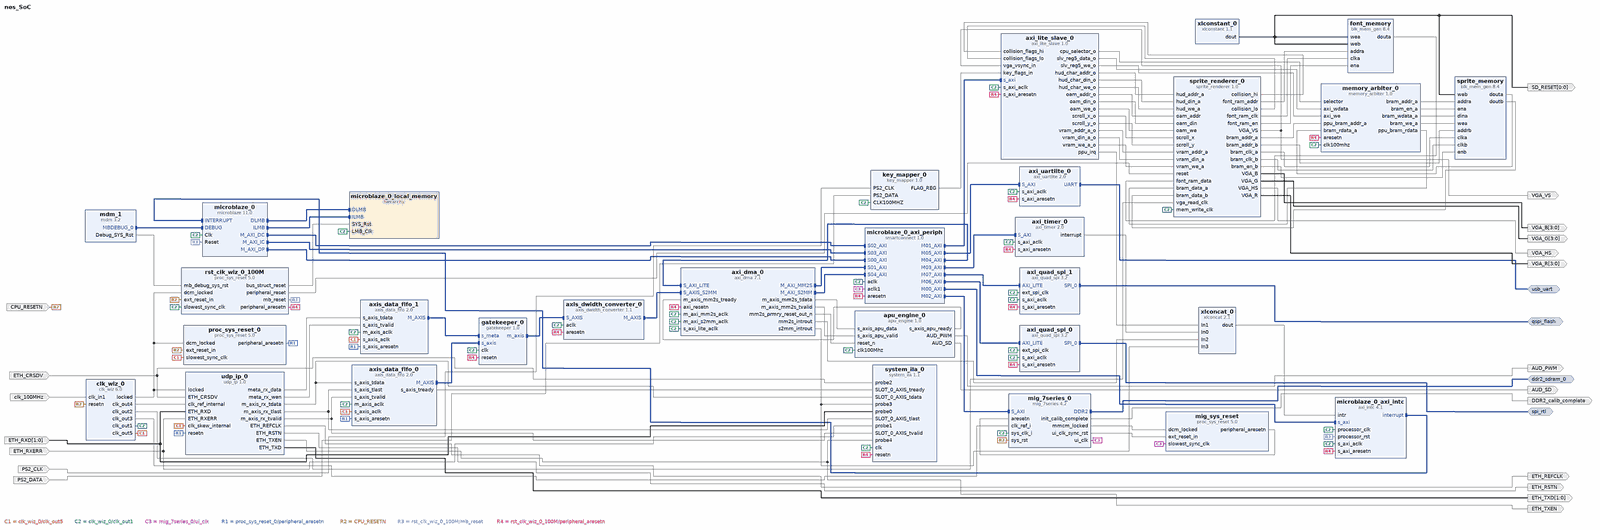
[diagram p0: block diagram of the top level, whole]
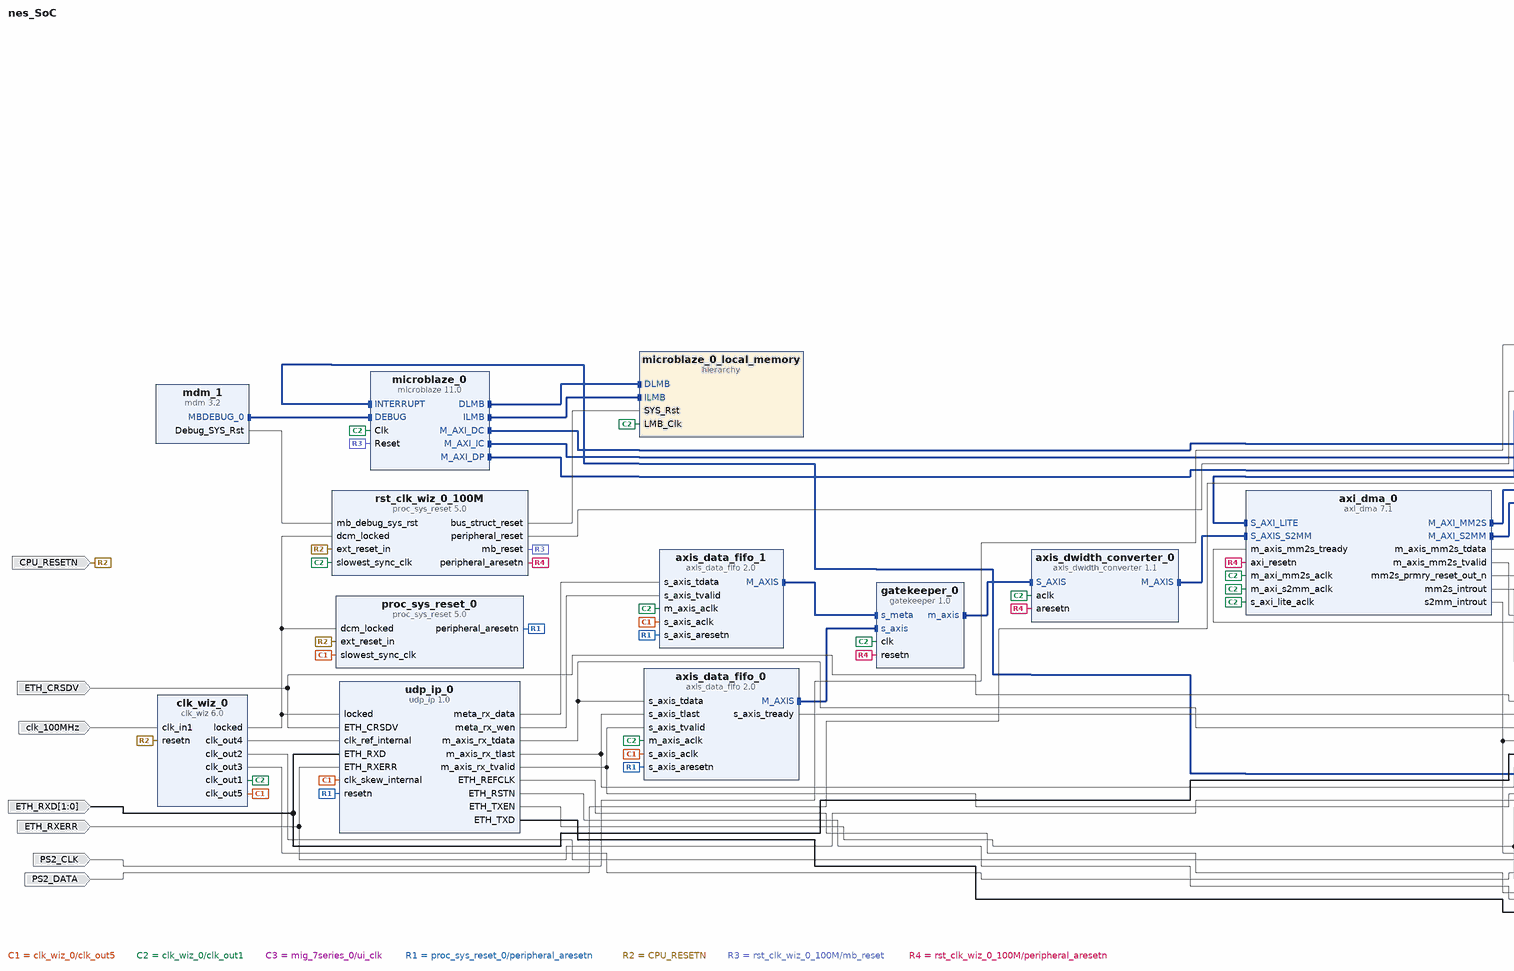
[diagram p1: block diagram of the top level, left part]
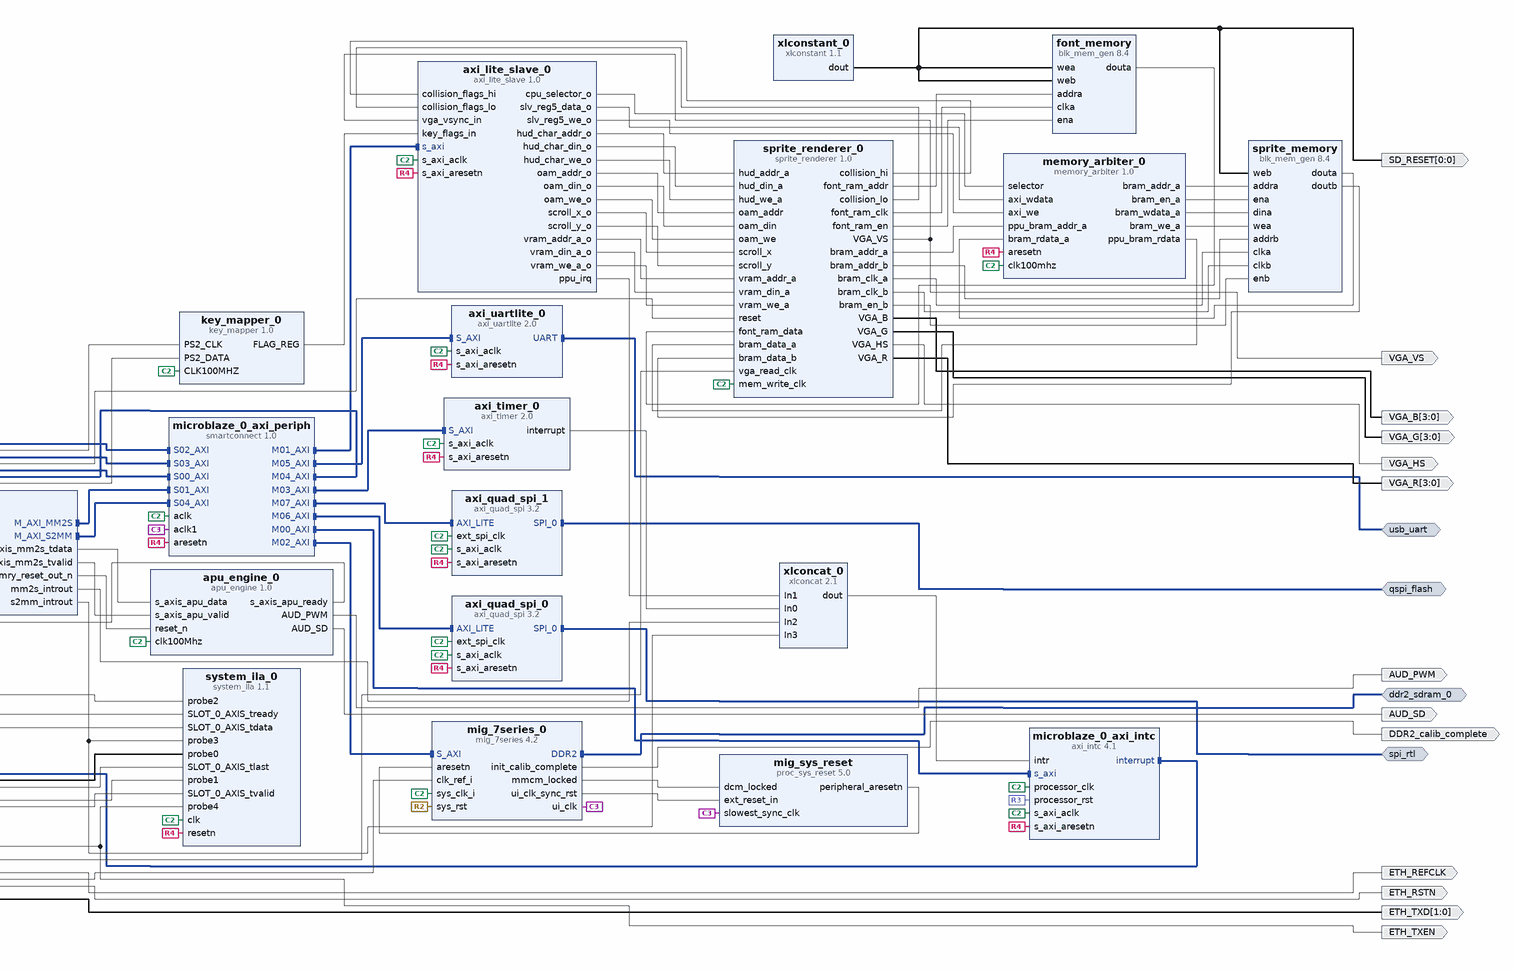
[diagram p2: block diagram of the top level, right part]
# Vivado block design nes_SoC, xc7a100tcsg324-1, Vivado 2025.2
create_bd_design nes_SoC

create_bd_intf_port -mode Master -vlnv xilinx.com:interface:ddrx_rtl:1.0 ddr2_sdram_0
create_bd_intf_port -mode Master -vlnv xilinx.com:interface:uart_rtl:1.0 usb_uart
create_bd_intf_port -mode Master -vlnv xilinx.com:interface:spi_rtl:1.0 spi_rtl
create_bd_intf_port -mode Master -vlnv xilinx.com:interface:spi_rtl:1.0 qspi_flash
create_bd_port -dir I -type clk clk_100MHz
set_property -dict {CONFIG.FREQ_HZ 100000000} [get_bd_ports clk_100MHz]
create_bd_port -dir I -type rst CPU_RESETN
set_property -dict {CONFIG.POLARITY ACTIVE_LOW} [get_bd_ports CPU_RESETN]
create_bd_port -dir I PS2_CLK
create_bd_port -dir I PS2_DATA
create_bd_port -dir O -from 3 -to 0 VGA_B
create_bd_port -dir O -from 3 -to 0 VGA_R
create_bd_port -dir O VGA_VS
create_bd_port -dir O -from 3 -to 0 VGA_G
create_bd_port -dir O VGA_HS
create_bd_port -dir O AUD_PWM
create_bd_port -dir O AUD_SD
create_bd_port -dir O DDR2_calib_complete
create_bd_port -dir O -from 0 -to 0 -type rst SD_RESET
create_bd_port -dir O ETH_REFCLK
create_bd_port -dir O -type rst ETH_RSTN
create_bd_port -dir O ETH_TXEN
create_bd_port -dir O -from 1 -to 0 ETH_TXD
create_bd_port -dir I ETH_CRSDV
create_bd_port -dir I ETH_RXERR
create_bd_port -dir I -from 1 -to 0 ETH_RXD

create_bd_cell -type ip -vlnv user.org:user:key_mapper:1.0 key_mapper_0
create_bd_cell -type ip -vlnv user.org:user:axi_lite_slave:1.0 axi_lite_slave_0
create_bd_cell -type ip -vlnv xilinx.com:ip:clk_wiz:6.0 clk_wiz_0
set_property -dict [list \
  CONFIG.CLKOUT1_DRIVES BUFG \
  CONFIG.CLKOUT1_JITTER 130.958 \
  CONFIG.CLKOUT1_PHASE_ERROR 98.575 \
  CONFIG.CLKOUT2_DRIVES BUFG \
  CONFIG.CLKOUT2_JITTER 175.402 \
  CONFIG.CLKOUT2_PHASE_ERROR 98.575 \
  CONFIG.CLKOUT2_REQUESTED_OUT_FREQ 25 \
  CONFIG.CLKOUT2_USED true \
  CONFIG.CLKOUT3_DRIVES BUFG \
  CONFIG.CLKOUT3_JITTER 114.829 \
  CONFIG.CLKOUT3_PHASE_ERROR 98.575 \
  CONFIG.CLKOUT3_REQUESTED_OUT_FREQ 200 \
  CONFIG.CLKOUT3_USED true \
  CONFIG.CLKOUT4_DRIVES BUFG \
  CONFIG.CLKOUT4_JITTER 151.636 \
  CONFIG.CLKOUT4_PHASE_ERROR 98.575 \
  CONFIG.CLKOUT4_REQUESTED_OUT_FREQ 50 \
  CONFIG.CLKOUT4_USED true \
  CONFIG.CLKOUT5_DRIVES BUFG \
  CONFIG.CLKOUT5_JITTER 151.636 \
  CONFIG.CLKOUT5_PHASE_ERROR 98.575 \
  CONFIG.CLKOUT5_REQUESTED_OUT_FREQ 50 \
  CONFIG.CLKOUT5_REQUESTED_PHASE 45 \
  CONFIG.CLKOUT5_USED true \
  CONFIG.CLKOUT6_DRIVES BUFG \
  CONFIG.CLKOUT7_DRIVES BUFG \
  CONFIG.MMCM_CLKFBOUT_MULT_F 10.000 \
  CONFIG.MMCM_CLKOUT0_DIVIDE_F 10.000 \
  CONFIG.MMCM_CLKOUT1_DIVIDE 40 \
  CONFIG.MMCM_CLKOUT2_DIVIDE 5 \
  CONFIG.MMCM_CLKOUT3_DIVIDE 20 \
  CONFIG.MMCM_CLKOUT4_DIVIDE 20 \
  CONFIG.MMCM_CLKOUT4_PHASE 45.000 \
  CONFIG.NUM_OUT_CLKS 5 \
  CONFIG.RESET_BOARD_INTERFACE reset \
  CONFIG.RESET_PORT resetn \
  CONFIG.RESET_TYPE ACTIVE_LOW \
  CONFIG.SECONDARY_SOURCE Single_ended_clock_capable_pin \
  CONFIG.USE_BOARD_FLOW true \
  CONFIG.USE_PHASE_ALIGNMENT true \
] [get_bd_cells clk_wiz_0]
create_bd_cell -type ip -vlnv xilinx.com:ip:blk_mem_gen:8.4 sprite_memory
set_property -dict [list \
  CONFIG.Assume_Synchronous_Clk false \
  CONFIG.Load_Init_File false \
  CONFIG.Memory_Type True_Dual_Port_RAM \
  CONFIG.Register_PortA_Output_of_Memory_Primitives false \
  CONFIG.Register_PortB_Output_of_Memory_Primitives false \
  CONFIG.Write_Depth_A 65536 \
  CONFIG.Write_Width_A 8 \
  CONFIG.use_bram_block Stand_Alone \
] [get_bd_cells sprite_memory]
create_bd_cell -type ip -vlnv xilinx.com:ip:proc_sys_reset:5.0 rst_clk_wiz_0_100M
set_property -dict {CONFIG.RESET_BOARD_INTERFACE reset CONFIG.USE_BOARD_FLOW true} [get_bd_cells rst_clk_wiz_0_100M]
create_bd_cell -type ip -vlnv xilinx.com:ip:microblaze:11.0 microblaze_0
set_property -dict [list \
  CONFIG.C_AREA_OPTIMIZED 0 \
  CONFIG.C_CACHE_BYTE_SIZE 8192 \
  CONFIG.C_DCACHE_BASEADDR 0x0000000088000000 \
  CONFIG.C_DCACHE_BYTE_SIZE 8192 \
  CONFIG.C_DCACHE_FORCE_TAG_LUTRAM 1 \
  CONFIG.C_DCACHE_HIGHADDR 0x000000008FFFFFFF \
  CONFIG.C_DEBUG_ENABLED 1 \
  CONFIG.C_D_AXI 1 \
  CONFIG.C_D_LMB 1 \
  CONFIG.C_ENABLE_CONVERSION 0 \
  CONFIG.C_ICACHE_BASEADDR 0x0000000088000000 \
  CONFIG.C_ICACHE_FORCE_TAG_LUTRAM 1 \
  CONFIG.C_ICACHE_HIGHADDR 0x000000008FFFFFFF \
  CONFIG.C_I_LMB 1 \
  CONFIG.C_USE_BARREL 1 \
  CONFIG.C_USE_DCACHE 1 \
  CONFIG.C_USE_ICACHE 1 \
  CONFIG.G_TEMPLATE_LIST 8 \
] [get_bd_cells microblaze_0]
create_bd_cell -type hier microblaze_0_local_memory
create_bd_cell -type ip -vlnv xilinx.com:ip:smartconnect:1.0 microblaze_0_axi_periph
set_property -dict {CONFIG.NUM_CLKS 2 CONFIG.NUM_MI 8 CONFIG.NUM_SI 5} [get_bd_cells microblaze_0_axi_periph]
create_bd_cell -type ip -vlnv xilinx.com:ip:axi_intc:4.1 microblaze_0_axi_intc
set_property -dict {CONFIG.C_HAS_FAST 1} [get_bd_cells microblaze_0_axi_intc]
create_bd_cell -type ip -vlnv xilinx.com:ip:mdm:3.2 mdm_1
create_bd_cell -type ip -vlnv user.org:user:sprite_renderer:1.0 sprite_renderer_0
create_bd_cell -type ip -vlnv xilinx.com:ip:xlconstant:1.1 xlconstant_0
set_property -dict {CONFIG.CONST_VAL 0} [get_bd_cells xlconstant_0]
create_bd_cell -type ip -vlnv xilinx.com:ip:axi_timer:2.0 axi_timer_0
create_bd_cell -type ip -vlnv xilinx.com:ip:xlconcat:2.1 xlconcat_0
set_property -dict {CONFIG.NUM_PORTS 4} [get_bd_cells xlconcat_0]
create_bd_cell -type ip -vlnv user.org:user:apu_engine:1.0 apu_engine_0
create_bd_cell -type ip -vlnv xilinx.com:ip:proc_sys_reset:5.0 mig_sys_reset
set_property -dict {CONFIG.RESET_BOARD_INTERFACE Custom CONFIG.USE_BOARD_FLOW true} [get_bd_cells mig_sys_reset]
create_bd_cell -type ip -vlnv xilinx.com:ip:mig_7series:4.2 mig_7series_0
set_property -dict [list \
  CONFIG.BOARD_MIG_PARAM ddr2_sdram \
  CONFIG.MIG_DONT_TOUCH_PARAM Custom \
  CONFIG.RESET_BOARD_INTERFACE Custom \
  CONFIG.XML_INPUT_FILE mig_b.prj \
] [get_bd_cells mig_7series_0]
create_bd_cell -type ip -vlnv xilinx.com:ip:blk_mem_gen:8.4 font_memory
set_property -dict [list \
  CONFIG.Coe_File ../../../../../../../../mario_assets/fonts/font_rom.coe \
  CONFIG.Load_Init_File true \
  CONFIG.Memory_Type True_Dual_Port_RAM \
  CONFIG.Register_PortA_Output_of_Memory_Primitives false \
  CONFIG.Register_PortB_Output_of_Memory_Primitives false \
  CONFIG.Write_Depth_A 512 \
  CONFIG.Write_Width_A 8 \
  CONFIG.use_bram_block Stand_Alone \
] [get_bd_cells font_memory]
create_bd_cell -type ip -vlnv xilinx.com:ip:axi_dma:7.1 axi_dma_0
set_property -dict [list \
  CONFIG.c_include_mm2s 1 \
  CONFIG.c_include_s2mm 1 \
  CONFIG.c_include_sg 0 \
  CONFIG.c_m_axi_s2mm_data_width 32 \
  CONFIG.c_s_axis_s2mm_tdata_width 32 \
  CONFIG.c_sg_length_width 26 \
] [get_bd_cells axi_dma_0]
create_bd_cell -type ip -vlnv xilinx.com:ip:axi_uartlite:2.0 axi_uartlite_0
set_property -dict [list \
  CONFIG.C_BAUDRATE 115200 \
  CONFIG.UARTLITE_BOARD_INTERFACE usb_uart \
  CONFIG.USE_BOARD_FLOW true \
] [get_bd_cells axi_uartlite_0]
create_bd_cell -type ip -vlnv xilinx.com:ip:axi_quad_spi:3.2 axi_quad_spi_0
set_property -dict [list \
  CONFIG.C_SCK_RATIO 4 \
  CONFIG.C_USE_STARTUP 0 \
  CONFIG.Master_mode 1 \
  CONFIG.QSPI_BOARD_INTERFACE Custom \
  CONFIG.USE_BOARD_FLOW true \
] [get_bd_cells axi_quad_spi_0]
create_bd_cell -type ip -vlnv user.org:user:memory_arbiter:1.0 memory_arbiter_0
create_bd_cell -type ip -vlnv xilinx.com:ip:axi_quad_spi:3.2 axi_quad_spi_1
set_property -dict {CONFIG.QSPI_BOARD_INTERFACE qspi_flash CONFIG.USE_BOARD_FLOW true} [get_bd_cells axi_quad_spi_1]
create_bd_cell -type ip -vlnv xilinx.com:ip:proc_sys_reset:5.0 proc_sys_reset_0
set_property -dict {CONFIG.RESET_BOARD_INTERFACE Custom CONFIG.USE_BOARD_FLOW true} [get_bd_cells proc_sys_reset_0]
create_bd_cell -type ip -vlnv xilinx.com:ip:system_ila:1.1 system_ila_0
set_property -dict [list \
  CONFIG.C_MON_TYPE MIX \
  CONFIG.C_NUM_MONITOR_SLOTS 1 \
  CONFIG.C_NUM_OF_PROBES 5 \
  CONFIG.C_PROBE0_WIDTH 2 \
  CONFIG.C_PROBE_WIDTH_PROPAGATION MANUAL \
  CONFIG.C_SLOT 0 \
  CONFIG.C_SLOT_0_INTF_TYPE xilinx.com:interface:axis_rtl:1.0 \
  CONFIG.C_SLOT_1_INTF_TYPE xilinx.com:interface:axis_rtl:1.0 \
  CONFIG.C_SLOT_2_INTF_TYPE xilinx.com:interface:axis_rtl:1.0 \
] [get_bd_cells system_ila_0]
create_bd_cell -type ip -vlnv xilinx.com:ip:axis_data_fifo:2.0 axis_data_fifo_0
set_property -dict [list \
  CONFIG.FIFO_DEPTH 32768 \
  CONFIG.FIFO_MEMORY_TYPE block \
  CONFIG.FIFO_MODE 2 \
  CONFIG.IS_ACLK_ASYNC 1 \
  CONFIG.TDATA_NUM_BYTES 1 \
] [get_bd_cells axis_data_fifo_0]
create_bd_cell -type ip -vlnv xilinx.com:ip:axis_dwidth_converter:1.1 axis_dwidth_converter_0
set_property -dict {CONFIG.HAS_TLAST 1 CONFIG.M_TDATA_NUM_BYTES 4} [get_bd_cells axis_dwidth_converter_0]
create_bd_cell -type ip -vlnv user.org:user:udp_ip:1.0 udp_ip_0
create_bd_cell -type ip -vlnv xilinx.com:ip:axis_data_fifo:2.0 axis_data_fifo_1
set_property -dict {CONFIG.FIFO_DEPTH 128 CONFIG.IS_ACLK_ASYNC 1} [get_bd_cells axis_data_fifo_1]
create_bd_cell -type ip -vlnv user.org:user:gatekeeper:1.0 gatekeeper_0

# ---- hierarchy /microblaze_0_local_memory ----
current_bd_instance /microblaze_0_local_memory
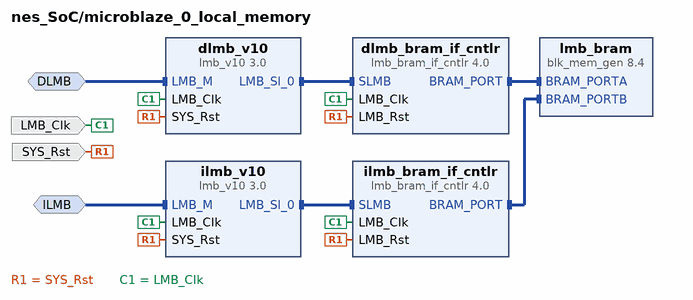
[diagram p3: block diagram inside /microblaze_0_local_memory]
create_bd_intf_pin -mode MirroredMaster -vlnv xilinx.com:interface:lmb_rtl:1.0 DLMB
create_bd_intf_pin -mode MirroredMaster -vlnv xilinx.com:interface:lmb_rtl:1.0 ILMB
create_bd_pin -dir I -type clk LMB_Clk
create_bd_pin -dir I -type rst SYS_Rst

create_bd_cell -type ip -vlnv xilinx.com:ip:lmb_v10:3.0 dlmb_v10
create_bd_cell -type ip -vlnv xilinx.com:ip:lmb_v10:3.0 ilmb_v10
create_bd_cell -type ip -vlnv xilinx.com:ip:lmb_bram_if_cntlr:4.0 dlmb_bram_if_cntlr
set_property -dict {CONFIG.C_ECC 0} [get_bd_cells dlmb_bram_if_cntlr]
create_bd_cell -type ip -vlnv xilinx.com:ip:lmb_bram_if_cntlr:4.0 ilmb_bram_if_cntlr
set_property -dict {CONFIG.C_ECC 0} [get_bd_cells ilmb_bram_if_cntlr]
create_bd_cell -type ip -vlnv xilinx.com:ip:blk_mem_gen:8.4 lmb_bram
set_property -dict {CONFIG.Memory_Type True_Dual_Port_RAM CONFIG.use_bram_block BRAM_Controller} [get_bd_cells lmb_bram]

# ---- connections ----

current_bd_instance /microblaze_0_local_memory
connect_bd_intf_net -intf_net microblaze_0_dlmb [get_bd_intf_pins dlmb_v10/LMB_M] [get_bd_intf_pins DLMB]
connect_bd_intf_net -intf_net microblaze_0_dlmb_bus [get_bd_intf_pins dlmb_v10/LMB_Sl_0] [get_bd_intf_pins dlmb_bram_if_cntlr/SLMB]
connect_bd_intf_net -intf_net microblaze_0_dlmb_cntlr [get_bd_intf_pins dlmb_bram_if_cntlr/BRAM_PORT] [get_bd_intf_pins lmb_bram/BRAM_PORTA]
connect_bd_intf_net -intf_net microblaze_0_ilmb [get_bd_intf_pins ilmb_v10/LMB_M] [get_bd_intf_pins ILMB]
connect_bd_intf_net -intf_net microblaze_0_ilmb_bus [get_bd_intf_pins ilmb_v10/LMB_Sl_0] [get_bd_intf_pins ilmb_bram_if_cntlr/SLMB]
connect_bd_intf_net -intf_net microblaze_0_ilmb_cntlr [get_bd_intf_pins ilmb_bram_if_cntlr/BRAM_PORT] [get_bd_intf_pins lmb_bram/BRAM_PORTB]
connect_bd_net [get_bd_pins SYS_Rst] \
  [get_bd_pins dlmb_v10/SYS_Rst] [get_bd_pins dlmb_bram_if_cntlr/LMB_Rst] [get_bd_pins ilmb_v10/SYS_Rst] \
  [get_bd_pins ilmb_bram_if_cntlr/LMB_Rst]
connect_bd_net -net microblaze_0_Clk [get_bd_pins LMB_Clk] \
  [get_bd_pins dlmb_v10/LMB_Clk] [get_bd_pins dlmb_bram_if_cntlr/LMB_Clk] [get_bd_pins ilmb_v10/LMB_Clk] \
  [get_bd_pins ilmb_bram_if_cntlr/LMB_Clk]
set_property HDL_ATTRIBUTE.BMM_INFO_ADDRESS_SPACE {byte  0x00000000 32 > nes_SoC microblaze_0_local_memory/lmb_bram} [get_bd_cells dlmb_bram_if_cntlr]
set_property HDL_ATTRIBUTE.KEEP_HIERARCHY yes [get_bd_cells dlmb_bram_if_cntlr]

current_bd_instance /
connect_bd_intf_net [get_bd_intf_pins axi_dma_0/M_AXI_MM2S] [get_bd_intf_pins microblaze_0_axi_periph/S01_AXI]
connect_bd_intf_net [get_bd_intf_pins axi_dma_0/M_AXI_S2MM] [get_bd_intf_pins microblaze_0_axi_periph/S04_AXI]
connect_bd_intf_net [get_bd_intf_ports spi_rtl] [get_bd_intf_pins axi_quad_spi_0/SPI_0]
connect_bd_intf_net [get_bd_intf_ports qspi_flash] [get_bd_intf_pins axi_quad_spi_1/SPI_0]
connect_bd_intf_net [get_bd_intf_ports usb_uart] [get_bd_intf_pins axi_uartlite_0/UART]
connect_bd_intf_net [get_bd_intf_pins axis_data_fifo_0/M_AXIS] [get_bd_intf_pins gatekeeper_0/s_axis]
connect_bd_intf_net [get_bd_intf_pins axis_data_fifo_1/M_AXIS] [get_bd_intf_pins gatekeeper_0/s_meta]
connect_bd_intf_net [get_bd_intf_pins axis_dwidth_converter_0/M_AXIS] [get_bd_intf_pins axi_dma_0/S_AXIS_S2MM]
connect_bd_intf_net [get_bd_intf_pins gatekeeper_0/m_axis] [get_bd_intf_pins axis_dwidth_converter_0/S_AXIS]
connect_bd_intf_net [get_bd_intf_pins microblaze_0/M_AXI_DC] [get_bd_intf_pins microblaze_0_axi_periph/S02_AXI]
connect_bd_intf_net [get_bd_intf_pins microblaze_0/M_AXI_IC] [get_bd_intf_pins microblaze_0_axi_periph/S03_AXI]
connect_bd_intf_net -intf_net microblaze_0_axi_dp [get_bd_intf_pins microblaze_0_axi_periph/S00_AXI] [get_bd_intf_pins microblaze_0/M_AXI_DP]
connect_bd_intf_net [get_bd_intf_pins microblaze_0_axi_periph/M01_AXI] [get_bd_intf_pins axi_lite_slave_0/s_axi]
connect_bd_intf_net [get_bd_intf_pins microblaze_0_axi_periph/M02_AXI] [get_bd_intf_pins mig_7series_0/S_AXI]
connect_bd_intf_net [get_bd_intf_pins microblaze_0_axi_periph/M03_AXI] [get_bd_intf_pins axi_timer_0/S_AXI]
connect_bd_intf_net [get_bd_intf_pins microblaze_0_axi_periph/M04_AXI] [get_bd_intf_pins axi_dma_0/S_AXI_LITE]
connect_bd_intf_net [get_bd_intf_pins microblaze_0_axi_periph/M05_AXI] [get_bd_intf_pins axi_uartlite_0/S_AXI]
connect_bd_intf_net [get_bd_intf_pins microblaze_0_axi_periph/M06_AXI] [get_bd_intf_pins axi_quad_spi_0/AXI_LITE]
connect_bd_intf_net [get_bd_intf_pins microblaze_0_axi_periph/M07_AXI] [get_bd_intf_pins axi_quad_spi_1/AXI_LITE]
connect_bd_intf_net [get_bd_intf_pins mdm_1/MBDEBUG_0] [get_bd_intf_pins microblaze_0/DEBUG]
connect_bd_intf_net [get_bd_intf_pins microblaze_0/DLMB] [get_bd_intf_pins microblaze_0_local_memory/DLMB]
connect_bd_intf_net [get_bd_intf_pins microblaze_0/ILMB] [get_bd_intf_pins microblaze_0_local_memory/ILMB]
connect_bd_intf_net -intf_net microblaze_0_intc_axi [get_bd_intf_pins microblaze_0_axi_periph/M00_AXI] [get_bd_intf_pins microblaze_0_axi_intc/s_axi]
connect_bd_intf_net [get_bd_intf_pins microblaze_0_axi_intc/interrupt] [get_bd_intf_pins microblaze_0/INTERRUPT]
connect_bd_intf_net [get_bd_intf_ports ddr2_sdram_0] [get_bd_intf_pins mig_7series_0/DDR2]
connect_bd_net -net ETH_CRSDV_0_1 [get_bd_ports ETH_CRSDV] [get_bd_pins system_ila_0/probe2] [get_bd_pins udp_ip_0/ETH_CRSDV]
connect_bd_net -net ETH_RXD_0_1 [get_bd_ports ETH_RXD] [get_bd_pins system_ila_0/probe0] [get_bd_pins udp_ip_0/ETH_RXD]
connect_bd_net -net ETH_RXERR_0_1 [get_bd_ports ETH_RXERR] [get_bd_pins system_ila_0/probe1] [get_bd_pins udp_ip_0/ETH_RXERR]
connect_bd_net -net PS2_CLK_0_1 [get_bd_ports PS2_CLK] [get_bd_pins key_mapper_0/PS2_CLK]
connect_bd_net -net PS2_DATA_0_1 [get_bd_ports PS2_DATA] [get_bd_pins key_mapper_0/PS2_DATA]
connect_bd_net [get_bd_pins apu_engine_0/AUD_PWM] [get_bd_ports AUD_PWM]
connect_bd_net [get_bd_pins apu_engine_0/AUD_SD] [get_bd_ports AUD_SD]
connect_bd_net [get_bd_pins apu_engine_0/s_axis_apu_ready] [get_bd_pins axi_dma_0/m_axis_mm2s_tready]
connect_bd_net [get_bd_pins axi_dma_0/m_axis_mm2s_tdata] [get_bd_pins apu_engine_0/s_axis_apu_data]
connect_bd_net [get_bd_pins axi_dma_0/m_axis_mm2s_tvalid] [get_bd_pins apu_engine_0/s_axis_apu_valid]
connect_bd_net [get_bd_pins axi_dma_0/mm2s_introut] [get_bd_pins xlconcat_0/In2]
connect_bd_net [get_bd_pins axi_dma_0/mm2s_prmry_reset_out_n] [get_bd_pins apu_engine_0/reset_n]
connect_bd_net [get_bd_pins axi_dma_0/s2mm_introut] [get_bd_pins xlconcat_0/In3] [get_bd_pins system_ila_0/probe3]
connect_bd_net -net axi_dma_0_s_axis_s2mm_tready [get_bd_pins axis_data_fifo_0/s_axis_tready] [get_bd_pins system_ila_0/SLOT_0_AXIS_tready]
connect_bd_net [get_bd_pins axi_lite_slave_0/cpu_selector_o] [get_bd_pins memory_arbiter_0/selector]
connect_bd_net [get_bd_pins axi_lite_slave_0/hud_char_addr_o] [get_bd_pins sprite_renderer_0/hud_addr_a]
connect_bd_net [get_bd_pins axi_lite_slave_0/hud_char_din_o] [get_bd_pins sprite_renderer_0/hud_din_a]
connect_bd_net [get_bd_pins axi_lite_slave_0/hud_char_we_o] [get_bd_pins sprite_renderer_0/hud_we_a]
connect_bd_net [get_bd_pins axi_lite_slave_0/oam_addr_o] [get_bd_pins sprite_renderer_0/oam_addr]
connect_bd_net [get_bd_pins axi_lite_slave_0/oam_din_o] [get_bd_pins sprite_renderer_0/oam_din]
connect_bd_net [get_bd_pins axi_lite_slave_0/oam_we_o] [get_bd_pins sprite_renderer_0/oam_we]
connect_bd_net [get_bd_pins axi_lite_slave_0/ppu_irq] [get_bd_pins xlconcat_0/In1]
connect_bd_net [get_bd_pins axi_lite_slave_0/scroll_x_o] [get_bd_pins sprite_renderer_0/scroll_x]
connect_bd_net [get_bd_pins axi_lite_slave_0/scroll_y_o] [get_bd_pins sprite_renderer_0/scroll_y]
connect_bd_net [get_bd_pins axi_lite_slave_0/slv_reg5_data_o] [get_bd_pins memory_arbiter_0/axi_wdata]
connect_bd_net [get_bd_pins axi_lite_slave_0/slv_reg5_we_o] [get_bd_pins memory_arbiter_0/axi_we]
connect_bd_net [get_bd_pins axi_lite_slave_0/vram_addr_a_o] [get_bd_pins sprite_renderer_0/vram_addr_a]
connect_bd_net [get_bd_pins axi_lite_slave_0/vram_din_a_o] [get_bd_pins sprite_renderer_0/vram_din_a]
connect_bd_net [get_bd_pins axi_lite_slave_0/vram_we_a_o] [get_bd_pins sprite_renderer_0/vram_we_a]
connect_bd_net [get_bd_pins axi_timer_0/interrupt] [get_bd_pins xlconcat_0/In0]
connect_bd_net [get_bd_ports clk_100MHz] [get_bd_pins clk_wiz_0/clk_in1]
connect_bd_net [get_bd_pins clk_wiz_0/clk_out2] [get_bd_pins sprite_renderer_0/vga_read_clk]
connect_bd_net [get_bd_pins clk_wiz_0/clk_out3] [get_bd_pins mig_7series_0/clk_ref_i]
connect_bd_net [get_bd_pins clk_wiz_0/clk_out4] [get_bd_pins udp_ip_0/clk_ref_internal]
connect_bd_net [get_bd_pins clk_wiz_0/clk_out5] \
  [get_bd_pins proc_sys_reset_0/slowest_sync_clk] [get_bd_pins axis_data_fifo_0/s_axis_aclk] \
  [get_bd_pins udp_ip_0/clk_skew_internal] [get_bd_pins axis_data_fifo_1/s_axis_aclk]
connect_bd_net [get_bd_pins clk_wiz_0/locked] \
  [get_bd_pins rst_clk_wiz_0_100M/dcm_locked] [get_bd_pins proc_sys_reset_0/dcm_locked] [get_bd_pins udp_ip_0/locked]
connect_bd_net [get_bd_pins font_memory/douta] [get_bd_pins sprite_renderer_0/font_ram_data]
connect_bd_net [get_bd_pins key_mapper_0/FLAG_REG] [get_bd_pins axi_lite_slave_0/key_flags_in]
connect_bd_net [get_bd_pins mdm_1/Debug_SYS_Rst] [get_bd_pins rst_clk_wiz_0_100M/mb_debug_sys_rst]
connect_bd_net [get_bd_pins memory_arbiter_0/bram_addr_a] [get_bd_pins sprite_memory/addra]
connect_bd_net [get_bd_pins memory_arbiter_0/bram_en_a] [get_bd_pins sprite_memory/ena]
connect_bd_net [get_bd_pins memory_arbiter_0/bram_wdata_a] [get_bd_pins sprite_memory/dina]
connect_bd_net [get_bd_pins memory_arbiter_0/bram_we_a] [get_bd_pins sprite_memory/wea]
connect_bd_net [get_bd_pins memory_arbiter_0/ppu_bram_rdata] [get_bd_pins sprite_renderer_0/bram_data_a]
connect_bd_net -net microblaze_0_Clk [get_bd_pins clk_wiz_0/clk_out1] \
  [get_bd_pins key_mapper_0/CLK100MHZ] [get_bd_pins microblaze_0/Clk] [get_bd_pins microblaze_0_axi_periph/aclk] \
  [get_bd_pins microblaze_0_axi_intc/s_axi_aclk] [get_bd_pins microblaze_0_axi_intc/processor_clk] \
  [get_bd_pins microblaze_0_local_memory/LMB_Clk] [get_bd_pins rst_clk_wiz_0_100M/slowest_sync_clk] \
  [get_bd_pins axi_timer_0/s_axi_aclk] [get_bd_pins mig_7series_0/sys_clk_i] [get_bd_pins axi_dma_0/m_axi_mm2s_aclk] \
  [get_bd_pins axi_dma_0/s_axi_lite_aclk] [get_bd_pins axi_uartlite_0/s_axi_aclk] [get_bd_pins axi_quad_spi_0/s_axi_aclk] \
  [get_bd_pins axi_quad_spi_0/ext_spi_clk] [get_bd_pins axi_lite_slave_0/s_axi_aclk] [get_bd_pins memory_arbiter_0/clk100mhz] \
  [get_bd_pins sprite_renderer_0/mem_write_clk] [get_bd_pins axi_quad_spi_1/s_axi_aclk] \
  [get_bd_pins axi_quad_spi_1/ext_spi_clk] [get_bd_pins apu_engine_0/clk100Mhz] [get_bd_pins axi_dma_0/m_axi_s2mm_aclk] \
  [get_bd_pins system_ila_0/clk] [get_bd_pins axis_data_fifo_0/m_axis_aclk] [get_bd_pins axis_dwidth_converter_0/aclk] \
  [get_bd_pins axis_data_fifo_1/m_axis_aclk] [get_bd_pins gatekeeper_0/clk]
connect_bd_net [get_bd_pins mig_7series_0/init_calib_complete] [get_bd_ports DDR2_calib_complete]
connect_bd_net [get_bd_pins mig_7series_0/mmcm_locked] [get_bd_pins mig_sys_reset/dcm_locked]
connect_bd_net [get_bd_pins mig_7series_0/ui_clk] [get_bd_pins microblaze_0_axi_periph/aclk1] [get_bd_pins mig_sys_reset/slowest_sync_clk]
connect_bd_net [get_bd_pins mig_7series_0/ui_clk_sync_rst] [get_bd_pins mig_sys_reset/ext_reset_in]
connect_bd_net [get_bd_pins mig_sys_reset/peripheral_aresetn] [get_bd_pins mig_7series_0/aresetn]
connect_bd_net [get_bd_pins proc_sys_reset_0/peripheral_aresetn] \
  [get_bd_pins axis_data_fifo_0/s_axis_aresetn] [get_bd_pins udp_ip_0/resetn] [get_bd_pins axis_data_fifo_1/s_axis_aresetn]
connect_bd_net -net reset_rtl_0_1 [get_bd_ports CPU_RESETN] \
  [get_bd_pins rst_clk_wiz_0_100M/ext_reset_in] [get_bd_pins clk_wiz_0/resetn] [get_bd_pins mig_7series_0/sys_rst] \
  [get_bd_pins proc_sys_reset_0/ext_reset_in]
connect_bd_net [get_bd_pins rst_clk_wiz_0_100M/bus_struct_reset] [get_bd_pins microblaze_0_local_memory/SYS_Rst]
connect_bd_net [get_bd_pins rst_clk_wiz_0_100M/mb_reset] [get_bd_pins microblaze_0/Reset] [get_bd_pins microblaze_0_axi_intc/processor_rst]
connect_bd_net [get_bd_pins rst_clk_wiz_0_100M/peripheral_aresetn] \
  [get_bd_pins microblaze_0_axi_periph/aresetn] [get_bd_pins microblaze_0_axi_intc/s_axi_aresetn] \
  [get_bd_pins axi_timer_0/s_axi_aresetn] [get_bd_pins axi_dma_0/axi_resetn] [get_bd_pins axi_uartlite_0/s_axi_aresetn] \
  [get_bd_pins axi_quad_spi_0/s_axi_aresetn] [get_bd_pins axi_lite_slave_0/s_axi_aresetn] \
  [get_bd_pins memory_arbiter_0/aresetn] [get_bd_pins axi_quad_spi_1/s_axi_aresetn] [get_bd_pins system_ila_0/resetn] \
  [get_bd_pins axis_dwidth_converter_0/aresetn] [get_bd_pins gatekeeper_0/resetn]
connect_bd_net [get_bd_pins rst_clk_wiz_0_100M/peripheral_reset] [get_bd_pins sprite_renderer_0/reset]
connect_bd_net [get_bd_pins sprite_memory/douta] [get_bd_pins memory_arbiter_0/bram_rdata_a]
connect_bd_net [get_bd_pins sprite_memory/doutb] [get_bd_pins sprite_renderer_0/bram_data_b]
connect_bd_net [get_bd_pins sprite_renderer_0/VGA_B] [get_bd_ports VGA_B]
connect_bd_net [get_bd_pins sprite_renderer_0/VGA_G] [get_bd_ports VGA_G]
connect_bd_net [get_bd_pins sprite_renderer_0/VGA_HS] [get_bd_ports VGA_HS]
connect_bd_net [get_bd_pins sprite_renderer_0/VGA_R] [get_bd_ports VGA_R]
connect_bd_net [get_bd_pins sprite_renderer_0/VGA_VS] [get_bd_ports VGA_VS] [get_bd_pins axi_lite_slave_0/vga_vsync_in]
connect_bd_net [get_bd_pins sprite_renderer_0/bram_addr_a] [get_bd_pins memory_arbiter_0/ppu_bram_addr_a]
connect_bd_net [get_bd_pins sprite_renderer_0/bram_addr_b] [get_bd_pins sprite_memory/addrb]
connect_bd_net [get_bd_pins sprite_renderer_0/bram_clk_a] [get_bd_pins sprite_memory/clka]
connect_bd_net [get_bd_pins sprite_renderer_0/bram_clk_b] [get_bd_pins sprite_memory/clkb]
connect_bd_net [get_bd_pins sprite_renderer_0/bram_en_b] [get_bd_pins sprite_memory/enb]
connect_bd_net [get_bd_pins sprite_renderer_0/collision_hi] [get_bd_pins axi_lite_slave_0/collision_flags_hi]
connect_bd_net [get_bd_pins sprite_renderer_0/collision_lo] [get_bd_pins axi_lite_slave_0/collision_flags_lo]
connect_bd_net [get_bd_pins sprite_renderer_0/font_ram_addr] [get_bd_pins font_memory/addra]
connect_bd_net [get_bd_pins sprite_renderer_0/font_ram_clk] [get_bd_pins font_memory/clka]
connect_bd_net [get_bd_pins sprite_renderer_0/font_ram_en] [get_bd_pins font_memory/ena]
connect_bd_net [get_bd_pins udp_ip_0/ETH_REFCLK] [get_bd_ports ETH_REFCLK]
connect_bd_net [get_bd_pins udp_ip_0/ETH_RSTN] [get_bd_ports ETH_RSTN]
connect_bd_net [get_bd_pins udp_ip_0/ETH_TXD] [get_bd_ports ETH_TXD]
connect_bd_net [get_bd_pins udp_ip_0/ETH_TXEN] [get_bd_ports ETH_TXEN] [get_bd_pins system_ila_0/probe4]
connect_bd_net -net udp_ip_0_m_axis_tdata [get_bd_pins udp_ip_0/m_axis_rx_tdata] \
  [get_bd_pins system_ila_0/SLOT_0_AXIS_tdata] [get_bd_pins axis_data_fifo_0/s_axis_tdata]
connect_bd_net -net udp_ip_0_m_axis_tlast [get_bd_pins udp_ip_0/m_axis_rx_tlast] \
  [get_bd_pins system_ila_0/SLOT_0_AXIS_tlast] [get_bd_pins axis_data_fifo_0/s_axis_tlast]
connect_bd_net -net udp_ip_0_m_axis_tvalid [get_bd_pins udp_ip_0/m_axis_rx_tvalid] \
  [get_bd_pins system_ila_0/SLOT_0_AXIS_tvalid] [get_bd_pins axis_data_fifo_0/s_axis_tvalid]
connect_bd_net [get_bd_pins udp_ip_0/meta_rx_data] [get_bd_pins axis_data_fifo_1/s_axis_tdata]
connect_bd_net [get_bd_pins udp_ip_0/meta_rx_wen] [get_bd_pins axis_data_fifo_1/s_axis_tvalid]
connect_bd_net [get_bd_pins xlconcat_0/dout] [get_bd_pins microblaze_0_axi_intc/intr]
connect_bd_net [get_bd_pins xlconstant_0/dout] \
  [get_bd_pins sprite_memory/web] [get_bd_pins font_memory/web] [get_bd_pins font_memory/wea] [get_bd_ports SD_RESET]
set_property HDL_ATTRIBUTE.BMM_INFO_PROCESSOR {microblaze-le > nes_SoC microblaze_0_local_memory/dlmb_bram_if_cntlr} [get_bd_cells microblaze_0]
set_property HDL_ATTRIBUTE.KEEP_HIERARCHY yes [get_bd_cells microblaze_0]

# ---- address map ----
assign_bd_address -offset 0x40600000 -range 64K -target_address_space [get_bd_addr_spaces axi_dma_0/Data_MM2S] [get_bd_addr_segs axi_uartlite_0/S_AXI/Reg]
assign_bd_address -offset 0x41200000 -range 64K -target_address_space [get_bd_addr_spaces axi_dma_0/Data_MM2S] [get_bd_addr_segs microblaze_0_axi_intc/S_AXI/Reg]
assign_bd_address -offset 0x41C00000 -range 64K -target_address_space [get_bd_addr_spaces axi_dma_0/Data_MM2S] [get_bd_addr_segs axi_timer_0/S_AXI/Reg]
assign_bd_address -offset 0x41E00000 -range 64K -target_address_space [get_bd_addr_spaces axi_dma_0/Data_MM2S] [get_bd_addr_segs axi_dma_0/S_AXI_LITE/Reg]
assign_bd_address -offset 0x44A00000 -range 64K -target_address_space [get_bd_addr_spaces axi_dma_0/Data_MM2S] [get_bd_addr_segs axi_quad_spi_0/AXI_LITE/Reg]
assign_bd_address -offset 0x80000000 -range 4K -target_address_space [get_bd_addr_spaces axi_dma_0/Data_MM2S] [get_bd_addr_segs axi_lite_slave_0/s_axi/reg0]
assign_bd_address -offset 0x88000000 -range 128M -target_address_space [get_bd_addr_spaces axi_dma_0/Data_MM2S] [get_bd_addr_segs mig_7series_0/memmap/memaddr]
exclude_bd_addr_seg -offset 0x44A10000 -range 64K -target_address_space [get_bd_addr_spaces axi_dma_0/Data_MM2S] [get_bd_addr_segs axi_quad_spi_1/AXI_LITE/Reg]
assign_bd_address -offset 0x88000000 -range 128M -target_address_space [get_bd_addr_spaces axi_dma_0/Data_S2MM] [get_bd_addr_segs mig_7series_0/memmap/memaddr]
exclude_bd_addr_seg -offset 0x00000000 -range 1G -target_address_space [get_bd_addr_spaces axi_dma_0/Data_S2MM] [get_bd_addr_segs axi_lite_slave_0/s_axi/reg0]
exclude_bd_addr_seg -offset 0x40600000 -range 64K -target_address_space [get_bd_addr_spaces axi_dma_0/Data_S2MM] [get_bd_addr_segs axi_uartlite_0/S_AXI/Reg]
exclude_bd_addr_seg -offset 0x41200000 -range 64K -target_address_space [get_bd_addr_spaces axi_dma_0/Data_S2MM] [get_bd_addr_segs microblaze_0_axi_intc/S_AXI/Reg]
exclude_bd_addr_seg -offset 0x41C00000 -range 64K -target_address_space [get_bd_addr_spaces axi_dma_0/Data_S2MM] [get_bd_addr_segs axi_timer_0/S_AXI/Reg]
exclude_bd_addr_seg -offset 0x41E00000 -range 64K -target_address_space [get_bd_addr_spaces axi_dma_0/Data_S2MM] [get_bd_addr_segs axi_dma_0/S_AXI_LITE/Reg]
exclude_bd_addr_seg -offset 0x44A00000 -range 64K -target_address_space [get_bd_addr_spaces axi_dma_0/Data_S2MM] [get_bd_addr_segs axi_quad_spi_0/AXI_LITE/Reg]
exclude_bd_addr_seg -offset 0x44A10000 -range 64K -target_address_space [get_bd_addr_spaces axi_dma_0/Data_S2MM] [get_bd_addr_segs axi_quad_spi_1/AXI_LITE/Reg]
assign_bd_address -offset 0x00000000 -range 64K -target_address_space [get_bd_addr_spaces microblaze_0/Data] [get_bd_addr_segs microblaze_0_local_memory/dlmb_bram_if_cntlr/SLMB/Mem]
assign_bd_address -offset 0x40600000 -range 64K -target_address_space [get_bd_addr_spaces microblaze_0/Data] [get_bd_addr_segs axi_uartlite_0/S_AXI/Reg]
assign_bd_address -offset 0x41200000 -range 64K -target_address_space [get_bd_addr_spaces microblaze_0/Data] [get_bd_addr_segs microblaze_0_axi_intc/S_AXI/Reg]
assign_bd_address -offset 0x41C00000 -range 64K -target_address_space [get_bd_addr_spaces microblaze_0/Data] [get_bd_addr_segs axi_timer_0/S_AXI/Reg]
assign_bd_address -offset 0x41E00000 -range 64K -target_address_space [get_bd_addr_spaces microblaze_0/Data] [get_bd_addr_segs axi_dma_0/S_AXI_LITE/Reg]
assign_bd_address -offset 0x44A00000 -range 64K -target_address_space [get_bd_addr_spaces microblaze_0/Data] [get_bd_addr_segs axi_quad_spi_0/AXI_LITE/Reg]
assign_bd_address -offset 0x44A10000 -range 64K -target_address_space [get_bd_addr_spaces microblaze_0/Data] [get_bd_addr_segs axi_quad_spi_1/AXI_LITE/Reg]
assign_bd_address -offset 0x80000000 -range 4K -target_address_space [get_bd_addr_spaces microblaze_0/Data] [get_bd_addr_segs axi_lite_slave_0/s_axi/reg0]
assign_bd_address -offset 0x88000000 -range 128M -target_address_space [get_bd_addr_spaces microblaze_0/Data] [get_bd_addr_segs mig_7series_0/memmap/memaddr]
assign_bd_address -offset 0x00000000 -range 64K -target_address_space [get_bd_addr_spaces microblaze_0/Instruction] [get_bd_addr_segs microblaze_0_local_memory/ilmb_bram_if_cntlr/SLMB/Mem]
assign_bd_address -offset 0x40600000 -range 64K -target_address_space [get_bd_addr_spaces microblaze_0/Instruction] [get_bd_addr_segs axi_uartlite_0/S_AXI/Reg]
assign_bd_address -offset 0x41200000 -range 64K -target_address_space [get_bd_addr_spaces microblaze_0/Instruction] [get_bd_addr_segs microblaze_0_axi_intc/S_AXI/Reg]
assign_bd_address -offset 0x41C00000 -range 64K -target_address_space [get_bd_addr_spaces microblaze_0/Instruction] [get_bd_addr_segs axi_timer_0/S_AXI/Reg]
assign_bd_address -offset 0x41E00000 -range 64K -target_address_space [get_bd_addr_spaces microblaze_0/Instruction] [get_bd_addr_segs axi_dma_0/S_AXI_LITE/Reg]
assign_bd_address -offset 0x44A00000 -range 64K -target_address_space [get_bd_addr_spaces microblaze_0/Instruction] [get_bd_addr_segs axi_quad_spi_0/AXI_LITE/Reg]
assign_bd_address -offset 0x44A10000 -range 64K -target_address_space [get_bd_addr_spaces microblaze_0/Instruction] [get_bd_addr_segs axi_quad_spi_1/AXI_LITE/Reg]
assign_bd_address -offset 0x80000000 -range 4K -target_address_space [get_bd_addr_spaces microblaze_0/Instruction] [get_bd_addr_segs axi_lite_slave_0/s_axi/reg0]
assign_bd_address -offset 0x88000000 -range 128M -target_address_space [get_bd_addr_spaces microblaze_0/Instruction] [get_bd_addr_segs mig_7series_0/memmap/memaddr]

validate_bd_design
save_bd_design
